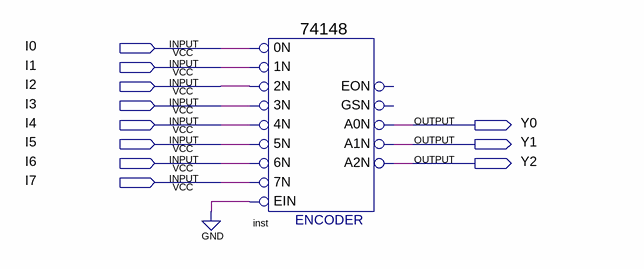
[diagram p0: schematic sheet]
// Quartus schematic enight_to_three_priority_encoder.bdf as structural Verilog: 1 symbols, 11 pins
module enight_to_three_priority_encoder (
  input  I0,
  input  I1,
  input  I2,
  input  I3,
  input  I4,
  input  I5,
  input  I6,
  input  I7,
  output Y0,
  output Y1,
  output Y2
);

  \74148  inst (
    .\5N (I5), .\0N (I0), .\1N (I1), .\2N (I2), .\3N (I3), .\4N (I4), .EIN(1'b0), .\6N (I6), .\7N (I7),
    .A1N(Y1), .A0N(Y0), .A2N(Y2));  // open: EON, GSN
endmodule
